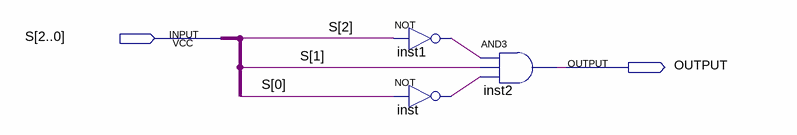
[diagram p0: schematic sheet]
// Quartus schematic operation_overflow_selector.bdf as structural Verilog: 3 symbols, 2 pins
module operation_overflow_selector (
  input  [2:0] S,
  output OUTPUT
);

  wire inst1_out, inst_out;

  not inst1 (inst1_out, S[2]);
  not inst (inst_out, S[0]);
  and inst2 (OUTPUT, inst1_out, S[1], inst_out);
endmodule
